# EasyEDA Pro project main_board.eprj

# Schematic Schematic1
Board Name: Board1; Create Date: 2025-07-29; Page Name: P1; Project Name: main_board; Schematic Name: Schematic1; Update Date: 2026-05-09; Company: EasyEDA.com; Page Size: A4; Version: V1.0
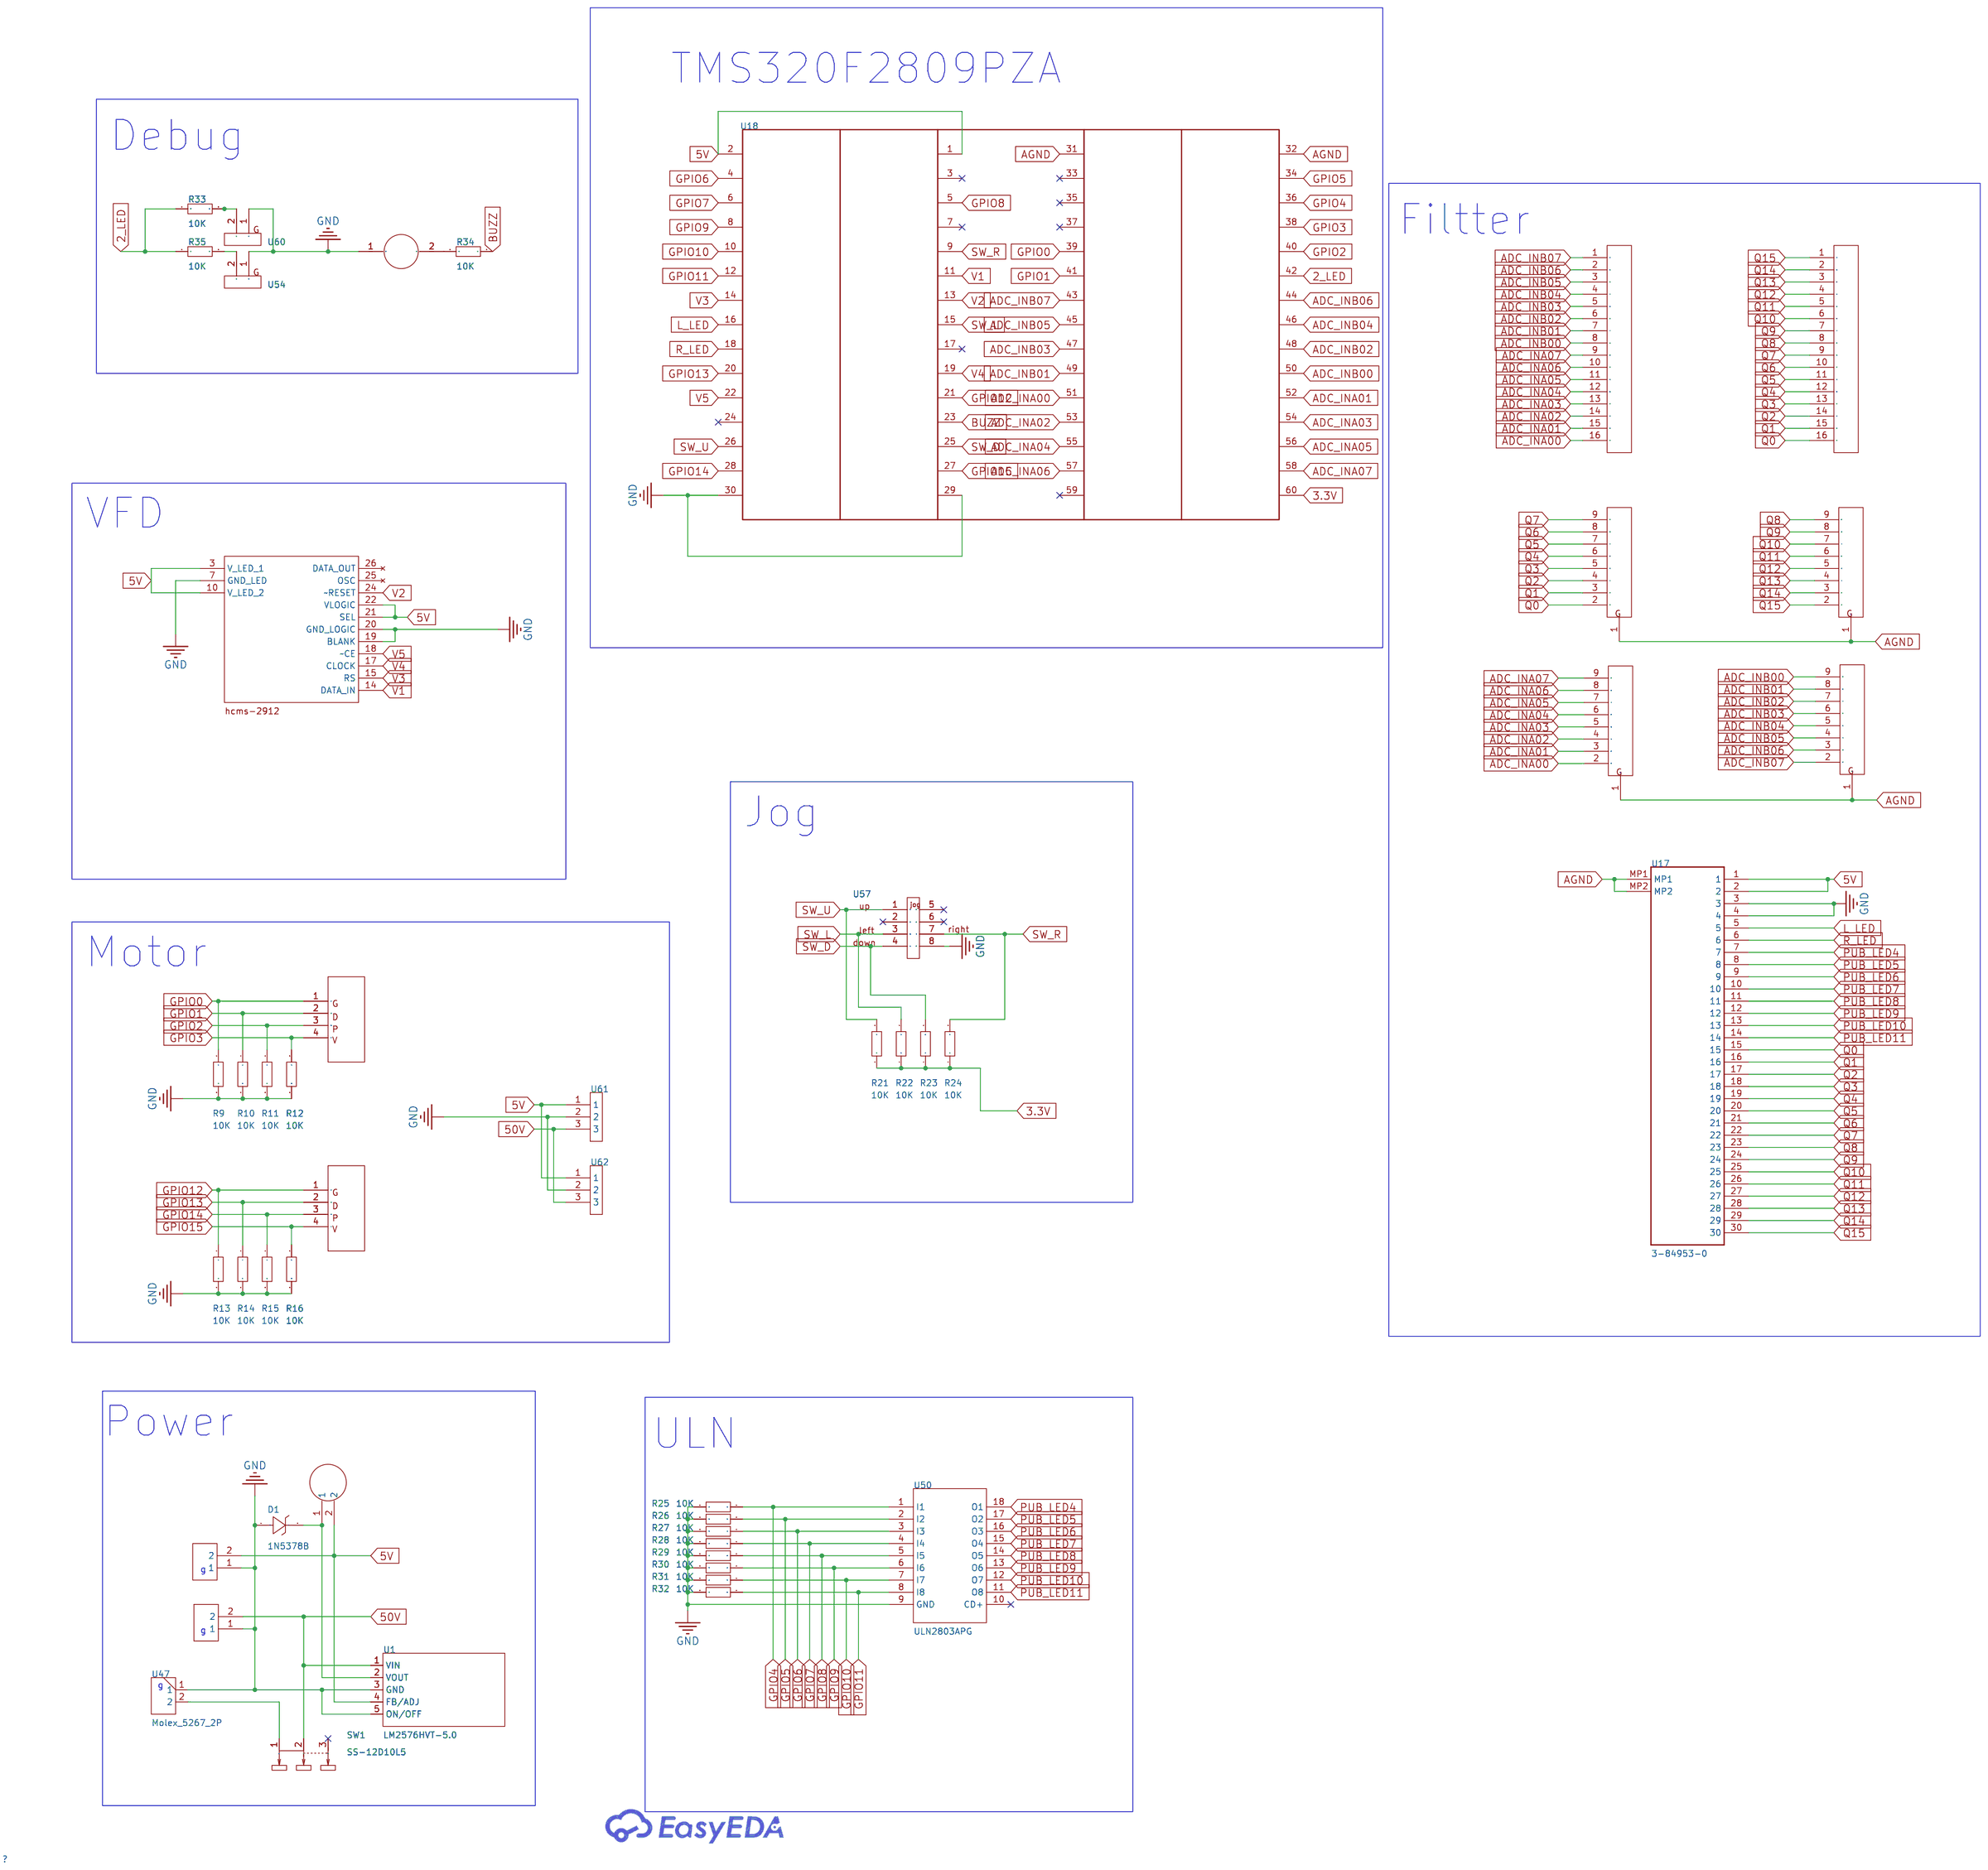
[diagram p0: schematic sheet]

## Parts
C1  -  [100uF Capacitor]
C2  -  [1000uF Capacitor]
D1  1N5378B  [DO-15_BD3.1-L6.7-P10.70-D0.9-FD]
L1  -  [Indoctor]
R9  10K  [R0603]
R10  10K  [R0603]
R11  10K  [R0603]
R12  10K  [R0603]
R13  10K  [R0603]
R14  10K  [R0603]
R15  10K  [R0603]
R16  10K  [R0603]
R21  10K  [R0603]
R22  10K  [R0603]
R23  10K  [R0603]
R24  10K  [R0603]
R25  10K  [R0603]
R26  10K  [R0603]
R27  10K  [R0603]
R28  10K  [R0603]
R29  10K  [R0603]
R30  10K  [R0603]
R31  10K  [R0603]
R32  10K  [R0603]
R33  10K  [R0603]
R34  10K  [R0603]
R35  10K  [R0603]
SW1  SS-12D10L5  [SW-TH_SS-12D10L5]
U1  LM2576HVT-5.0  [TO-220-5L_L10.2-W4.5-P1.71-L]
U4  Driver_R  [DC_Main_to_Motordriver_Connector_L]
U6  -  [BUZZER]
U10  -  [HCMS-2912]
U11  -  [Array]
U12  -  [Array]
U15  -  [C_Array]
U16  -  [C_Array]
U17  3-84953-0  [3849530]
U18  -  [2809PCB]
U47  Molex_5267_2P  [5267_2P]
U48  Driver_L  [DC_Main_to_Motordriver_Connector_L]
U50  ULN2803APG  [DIP-18_L23.0-W6.5-P2.54-LS7.6-BL]
U51  -  [Array]
U52  -  [Array]
U54  -  [pub_pin]
U57  -  [jog]
U60  -  [pub_pin]
U61  -  [pin]
U62  -  [pin]

## Library data of the parts
C1 = 100uF Capacitor
C2 = 1000uF Capacitor
D1 = 1N5378B: Zener Voltage(Nom):100V Reverse Leakage Current (Ir):500nA@76V Pd - Power Dissipation:5W Impedance(Zzt):90Ω; Supplier Part: C2988330; Manufacturer: EIC; Supplier Footprint: DO-15; JLCPCB Part Class: Extended Part; Datasheet: https://atta.szlcsc.com/upload/public/pdf/source/20220402/75CFD8A39FA764DF5610AA6DE4D072CD.pdf; Supplier: LCSC; Zener Voltage(Nom): 100V; Reverse Leakage Current (Ir): 500nA@76V; Pd - Power Dissipation: 5W; Impedance(Zzt): 90Ω
L1 = Indoctor
R9-R16 R21-R35 = Res_0603: Supplier Footprint: 0603
SW1 = SS-12D10L5: LCSC Part Name: 柄长5mm 直插双档 滑动开关; Supplier Part: C319012; Manufacturer: XKB Connectivity(中国星坤); Supplier Footprint: 插件; JLCPCB Part Class: Extended Part; Datasheet: https://atta.szlcsc.com/upload/public/pdf/source/20211009/D6412F37AABE6F9459A6EE7FA4DAEADB.pdf; Supplier: LCSC; Circuit: SPDT; Actuator Style: Rectangular columnar; Pin Style: PCPin; Switch Length: 13mm; Switch Width: 6.8mm; Switch Height: 6.4mm; Mounting Style: Straight; Actuator Color: Black; Current Rating (DC): 3A; Voltage Rating (DC): 125V; Current Rating (AC): 3A; Voltage Rating (AC): 125V; Mechanical Life: 1万次; Operating Temperature: -40℃~+85℃
U1 = LM2576HVT-5.0_C262789: Function:Step-down type Output Type:- Voltage - Supply:- Voltage - Supply:- Output Voltage:- Output Voltage:- Output Current:3A Frequency - Switching:52kHz Frequency - Switching:52kHz Operating Temperature:-40℃~+125℃ Operating Temperature:-40℃~+125℃ Synch; Supplier Part: C262789; Manufacturer: HTC; Supplier Footprint: TO-220-5; JLCPCB Part Class: Extended Part; Datasheet: https://atta.szlcsc.com/upload/public/pdf/source/20191203/C126037_E42ABC3D16C6AA3446C45CA7229A4210.pdf; Supplier: LCSC; Function: Step-down type; Output Current: 3A; Frequency - Switching: 52kHz; Operating Temperature: -40℃~+125℃; Number of Outputs: 1; Topology: Step-down; Switch tube (built-in/external): Built-in
U4 U48 = DC_Main_to_Motordriver_Connector
U6 = BUZZER
U10 = HCMS-2912
U11 U12 U51 U52 = Array
U15 U16 = C_Array
U17 = 3-84953-0
U18 = TMS320F2809PZA_DIP
U47 = Molex_5267_2P
U50 = ULN2803APG: LCSC Part Name: 停产 ULN2803APG; Supplier Part: C5252; Manufacturer: TOSHIBA(东芝); Supplier Footprint: DIP-18; JLCPCB Part Class: Extended Part; Datasheet: https://atta.szlcsc.com/upload/public/pdf/source/20120920/1457706536068.pdf; Supplier: LCSC; number of channels: Eight channels
U54 U60 = pub_pin
U57 = jog
U61 U62 = 3pin

## Nets
3.3V: R21.1 R22.1 R23.1 R24.1 U18.60
5V: C2.2 L1.2 U1.4(FB/ADJ) U10.3(V_LED_1) U10.10(V_LED_2) U10.21(SEL) U10.22(VLOGIC) U17.1 U17.2 U18.1 U18.2 U61.1 U62.1
50V: C1.2 SW1.2 U1.1(VIN) U61.3 U62.3
AGND: U11.1 U12.1 U17.MP1 U17.MP2 U18.31 U18.32 U51.1 U52.1
GND: C1.1 C2.1 D1.1(+) R9.2 R10.2 R11.2 R12.2 R13.2 R14.2 R15.2 R16.2 R25.2 R26.2 R27.2 R28.2 R29.2 R30.2 R31.2 R32.2 U1.3(GND) U1.5(ON/OFF) U6.1 U10.7(GND_LED) U10.19(BLANK) U10.20(GND_LOGIC) U17.3 U17.4 U18.29 U18.30 U47.1 U50.9(GND) U54.1 U57.8 U60.1 U61.2 U62.2
V1: U10.14(DATA_IN) U18.11
V2: U10.24(~RESET) U18.13
V3: U10.15(RS) U18.14
V4: U10.17(CLOCK) U18.19
V5: U10.18(~CE) U18.22
2_LED: R33.1 R35.1 U18.42
ADC_INA00: U15.16 U18.51 U51.2
ADC_INA01: U15.15 U18.52 U51.3
ADC_INA02: U15.14 U18.53 U51.4
ADC_INA03: U15.13 U18.54 U51.5
ADC_INA04: U15.12 U18.55 U51.6
ADC_INA05: U15.11 U18.56 U51.7
ADC_INA06: U15.10 U18.57 U51.8
ADC_INA07: U15.9 U18.58 U51.9
ADC_INB00: U15.8 U18.50 U52.9
ADC_INB01: U15.7 U18.49 U52.8
ADC_INB02: U15.6 U18.48 U52.7
ADC_INB03: U15.5 U18.47 U52.6
ADC_INB04: U15.4 U18.46 U52.5
ADC_INB05: U15.3 U18.45 U52.4
ADC_INB06: U15.2 U18.44 U52.3
ADC_INB07: U15.1 U18.43 U52.2
BUZZ: R34.2 U18.23
GPIO0: R9.1 U4.1 U18.39
GPIO1: R10.1 U4.2 U18.41
GPIO2: R11.1 U4.3 U18.40
GPIO3: R12.1 U4.4 U18.38
GPIO4: R25.1 U18.36 U50.1(I1)
GPIO5: R26.1 U18.34 U50.2(I2)
GPIO6: R27.1 U18.4 U50.3(I3)
GPIO7: R28.1 U18.6 U50.4(I4)
GPIO8: R29.1 U18.5 U50.5(I5)
GPIO9: R30.1 U18.8 U50.6(I6)
GPIO10: R31.1 U18.10 U50.7(I7)
GPIO11: R32.1 U18.12 U50.8(I8)
GPIO12: R13.1 U18.21 U48.1
GPIO13: R14.1 U18.20 U48.2
GPIO14: R15.1 U18.28 U48.3
GPIO15: R16.1 U18.27 U48.4
L_LED: U17.5 U18.16
PUB_LED4: U17.7 U50.18(O1)
PUB_LED5: U17.8 U50.17(O2)
PUB_LED6: U17.9 U50.16(O3)
PUB_LED7: U17.10 U50.15(O4)
PUB_LED8: U17.11 U50.14(O5)
PUB_LED9: U17.12 U50.13(O6)
PUB_LED10: U17.13 U50.12(O7)
PUB_LED11: U17.14 U50.11(O8)
Q0: U11.2 U16.16 U17.15
Q1: U11.3 U16.15 U17.16
Q2: U11.4 U16.14 U17.17
Q3: U11.5 U16.13 U17.18
Q4: U11.6 U16.12 U17.19
Q5: U11.7 U16.11 U17.20
Q6: U11.8 U16.10 U17.21
Q7: U11.9 U16.9 U17.22
Q8: U12.9 U16.8 U17.23
Q9: U12.8 U16.7 U17.24
Q10: U12.7 U16.6 U17.25
Q11: U12.6 U16.5 U17.26
Q12: U12.5 U16.4 U17.27
Q13: U12.4 U16.3 U17.28
Q14: U12.3 U16.2 U17.29
Q15: U12.2 U16.1 U17.30
R_LED: U17.6 U18.18
SW_D: R23.2 U18.25 U57.4
SW_L: R22.2 U18.15 U57.3
SW_R: R24.2 U18.9 U57.7
SW_U: R21.2 U18.26 U57.1
$1N2932: SW1.1 U47.2
$1N3052: D1.2(-) L1.1 U1.2(VOUT)
$1N13779: R34.1 U6.2
$1N16910: R33.2 U60.2
$1N16913: R35.2 U54.2

Not connected (* = marked no-connect by the designer): SW1 3*; U10 25(OSC) 26(DATA_OUT); U18 3* 7* 17* 24* 33* 35* 37* 59*; U50 10(CD+)*; U57 2* 5* 6*

## Notes on the sheet
- TMS320F2809PZA
- Debug
- Filtter
- VFD
- Jog
- Motor
- Power
- ULN
- g
- g
- g

# Board PCB1
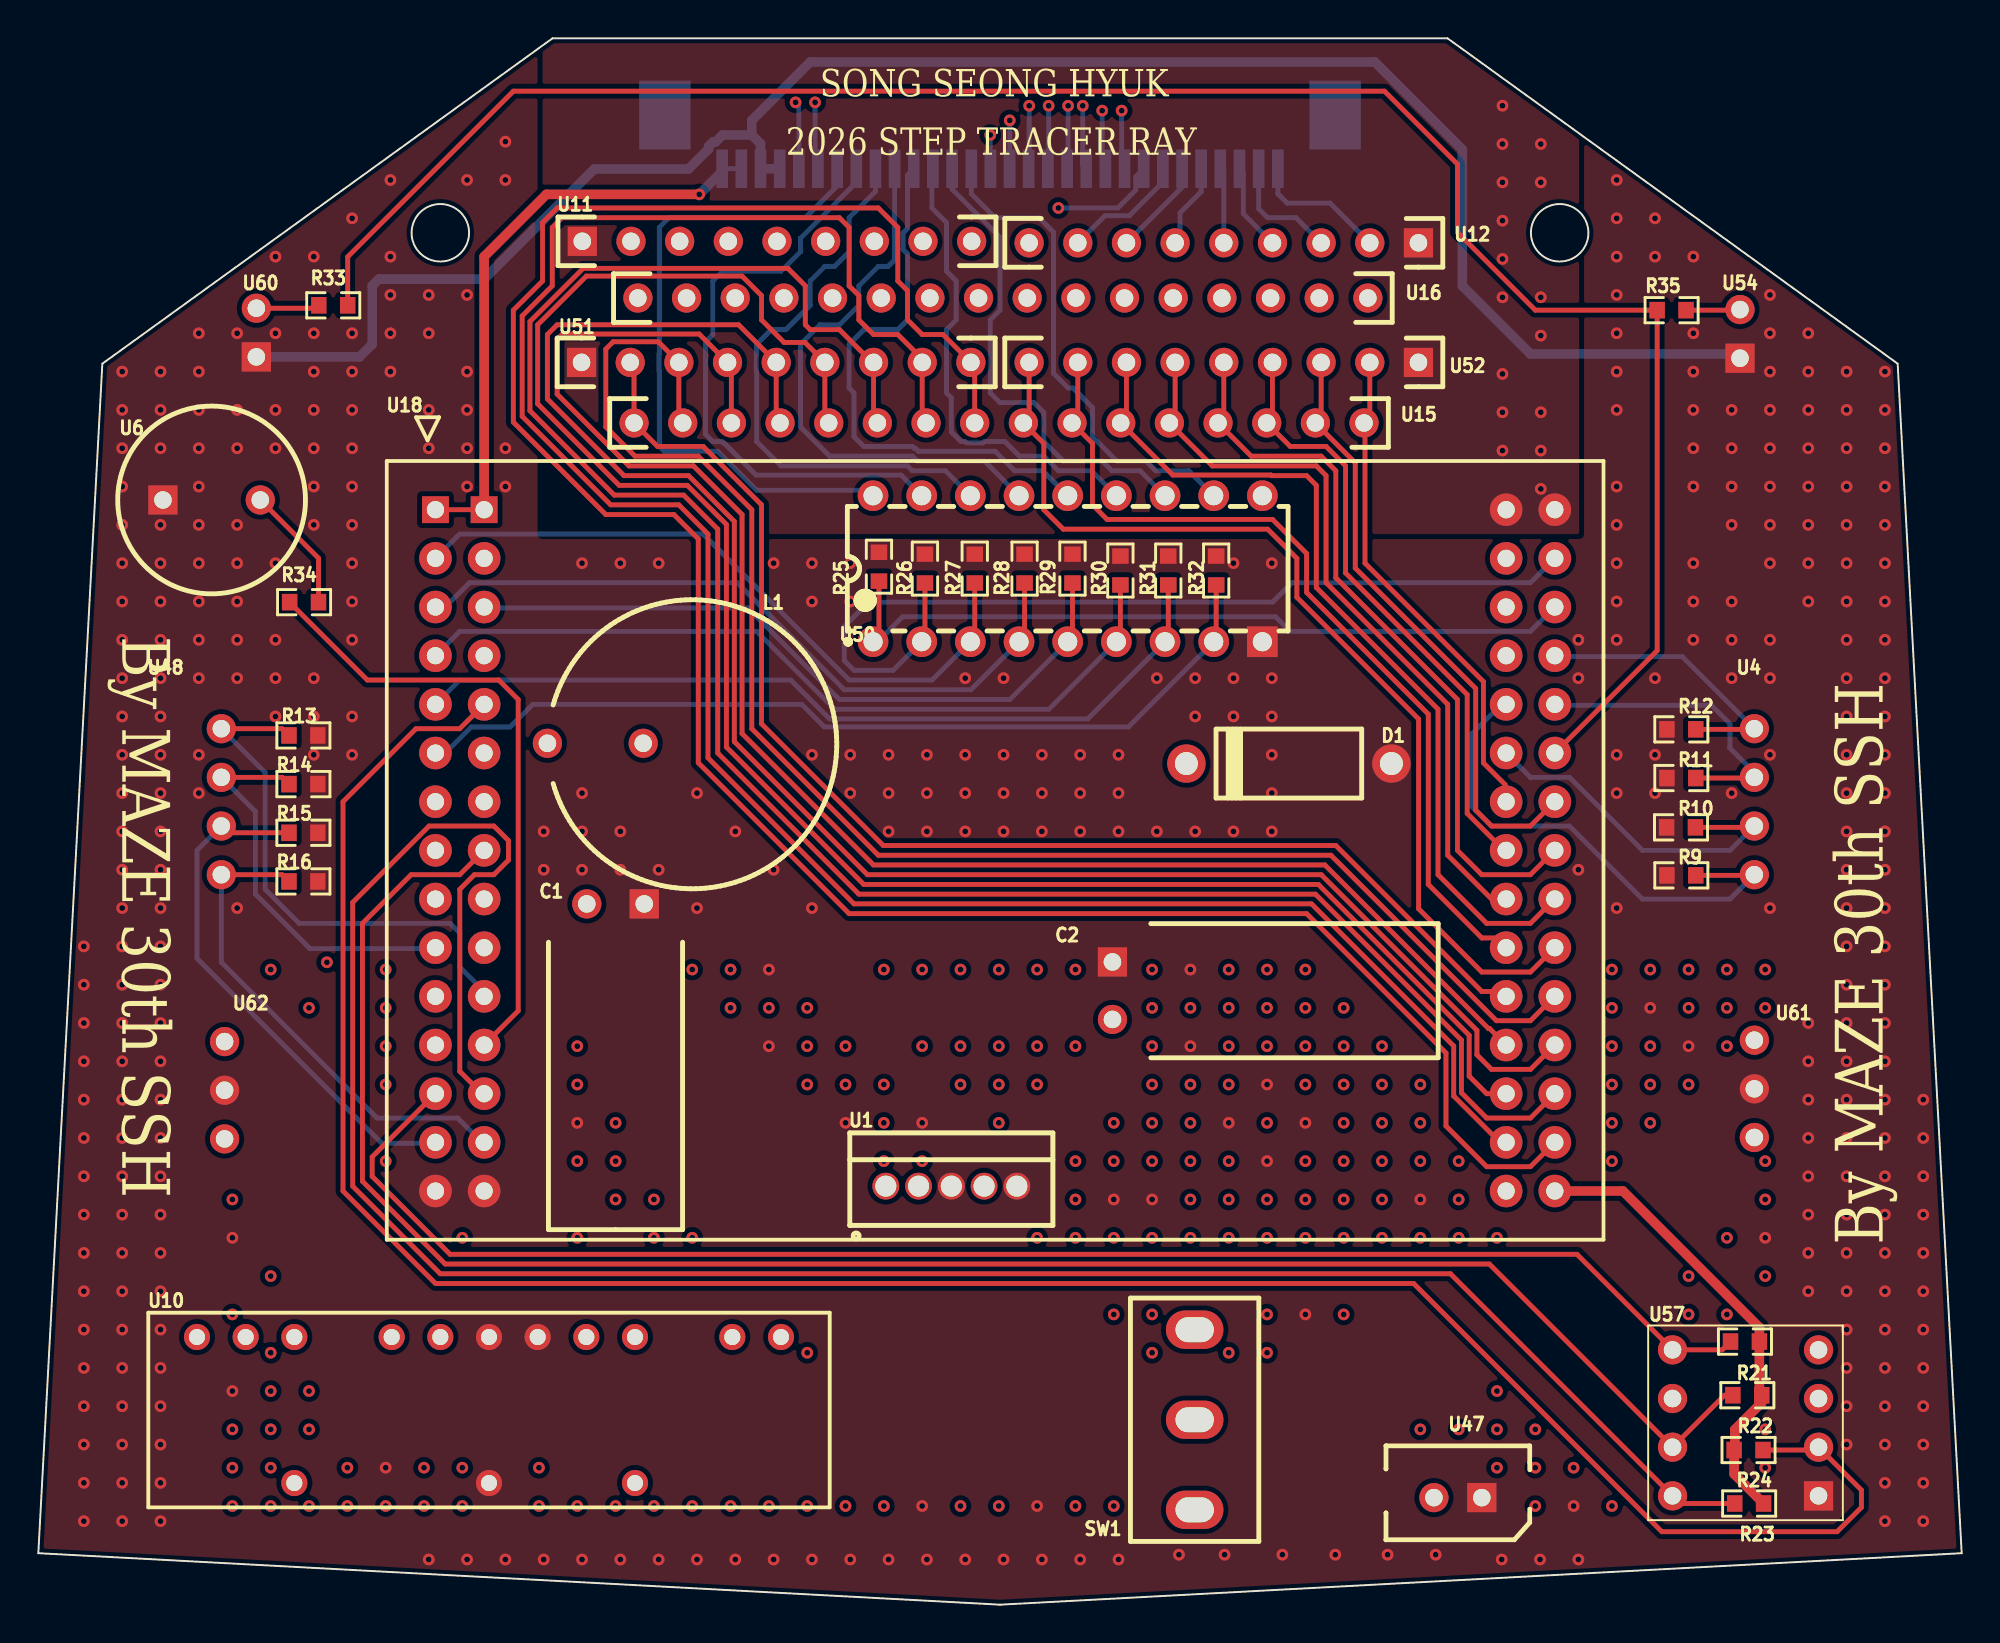
[diagram p1: board, top side]
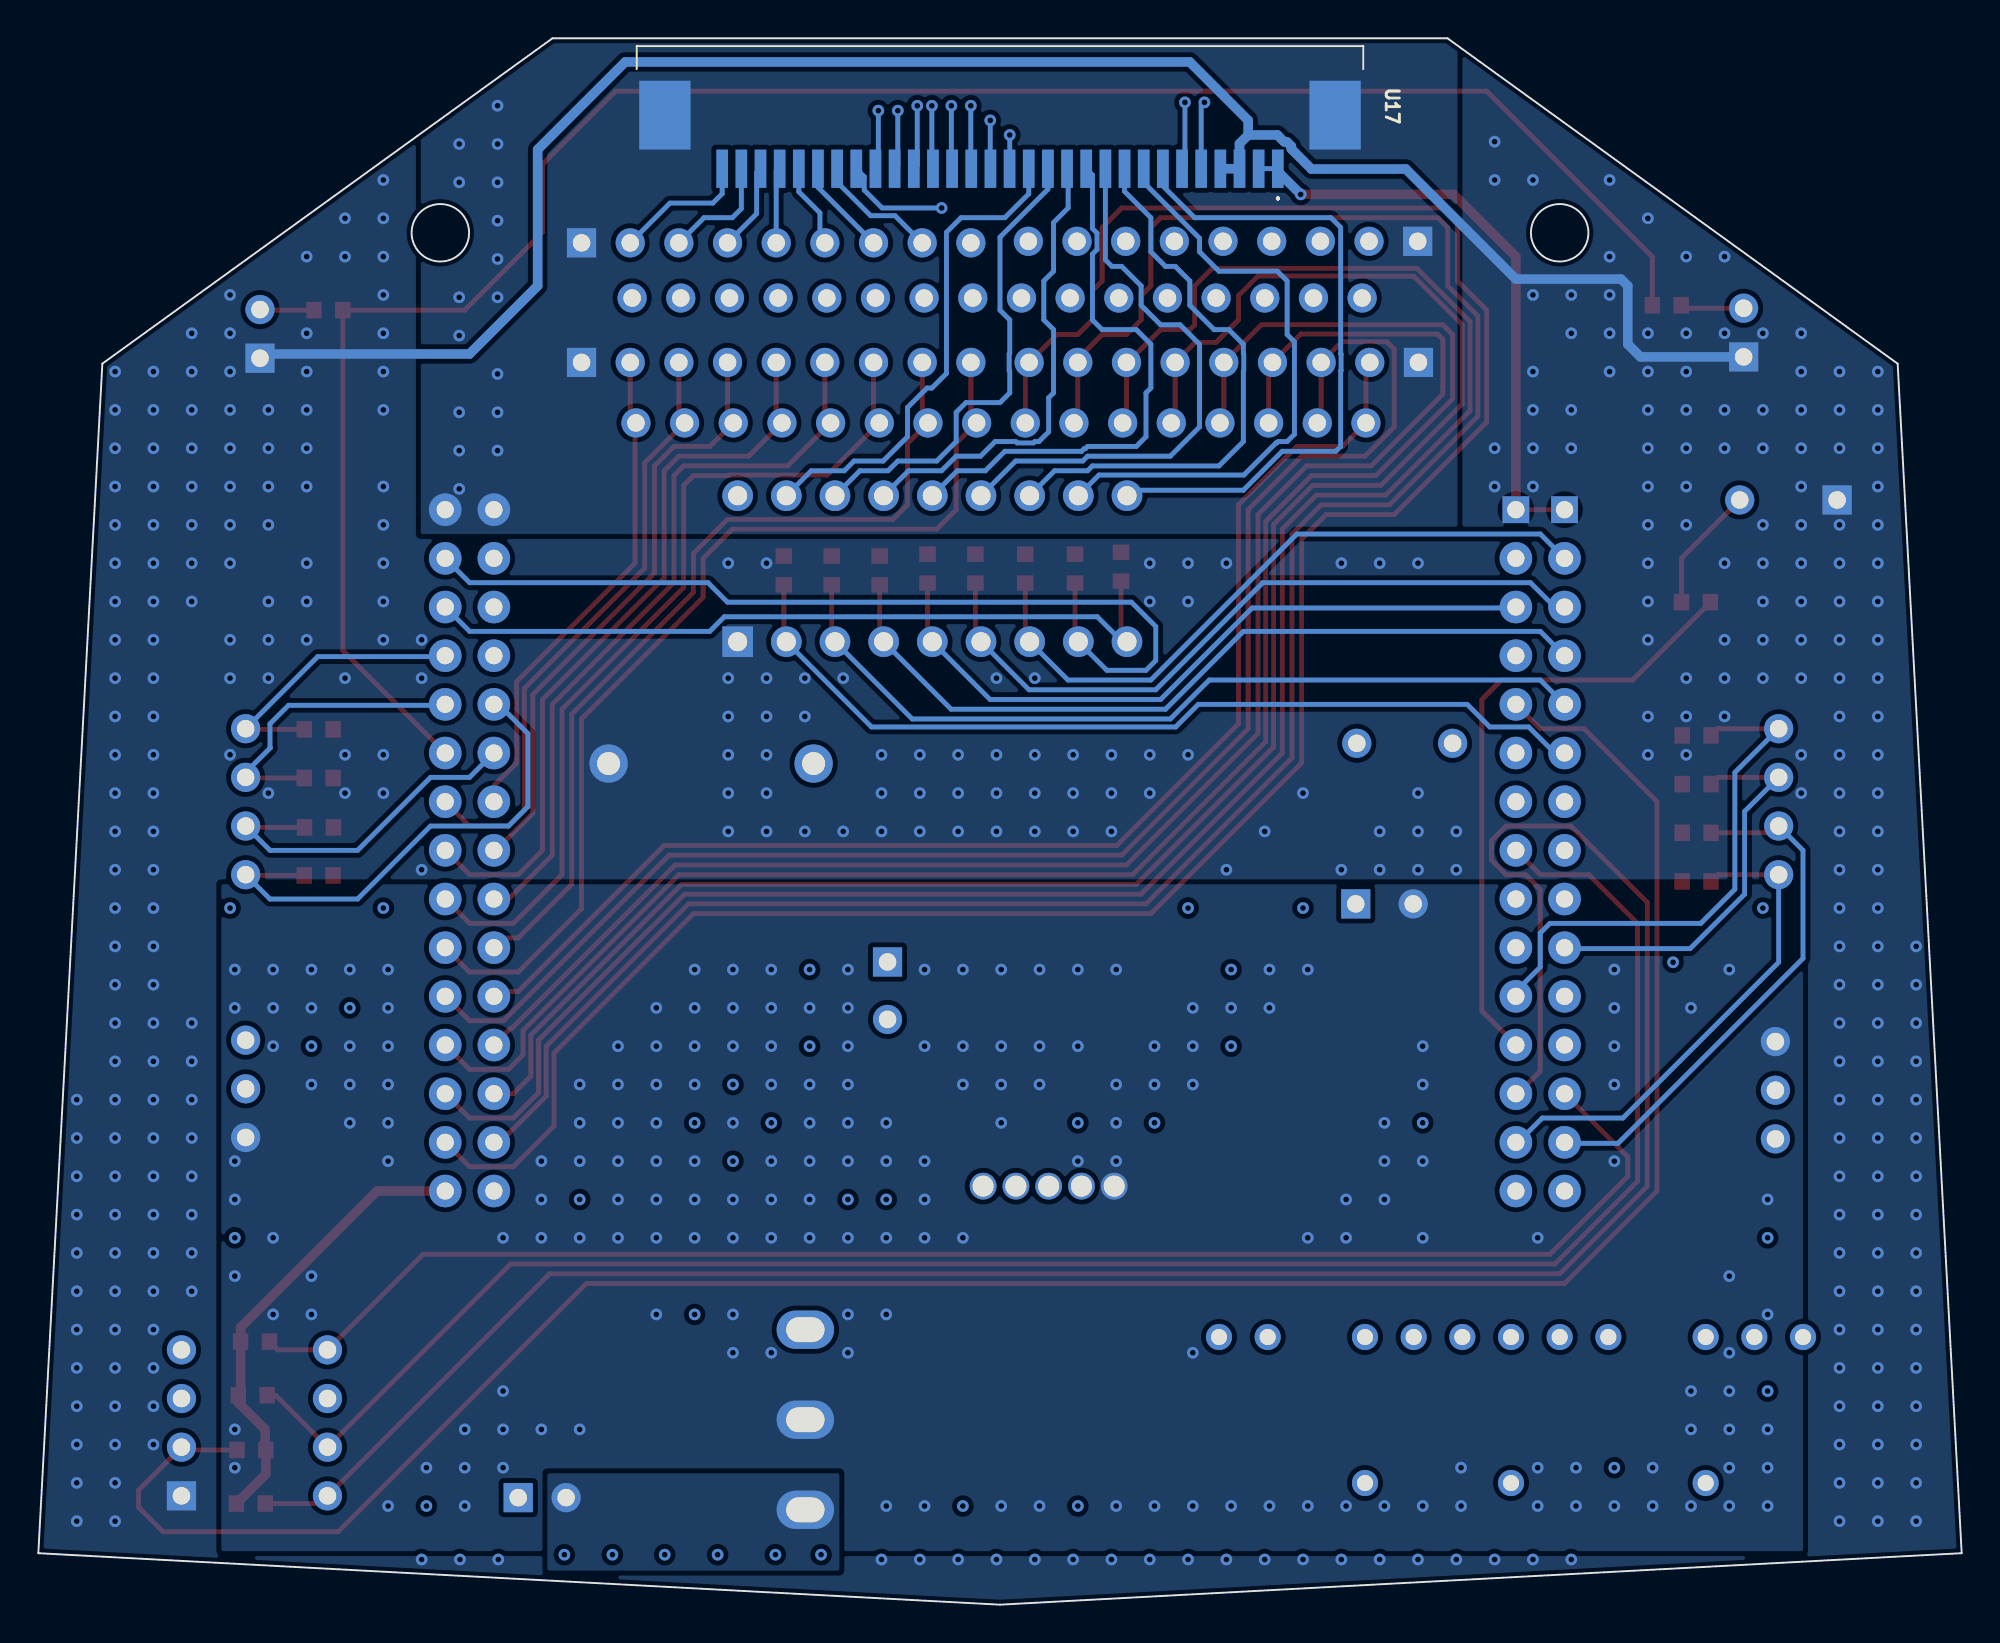
[diagram p2: board, bottom side, seen from below]

Outline 100.38 x 81.75 mm; copper layers: Top Layer, Inner1, Inner2, Bottom Layer. Coordinates in mm from the lower left corner of the outline.
Outline path: circle c20.98,71.6 r1.5 ; circle c79.4,71.6 r1.5 ; 0,2.69 3.34,64.77 26.83,81.75 73.55,81.75 97.04,64.77 100.38,2.69 50.19,0 0,2.69
Stack: Top Layer 0.035mm Outer layer thickness 1oz / Dielectric1 0.2104mm 7628 RC49% 8.6mil / Inner1 0.0152mm Inner layer thickness / Dielectric2 1.065mm 1.1mm H/HOZ Copper / Inner2 0.0152mm Inner layer thickness / Dielectric3 0.2104mm 7628 RC49% 8.6mil / Bottom Layer 0.035mm Outer layer thickness 1oz

## Design rules (mm)
template: Custom Config
spacing copperThickness1oz (default): track to track 0.15, other pairs 0.152 to 0.3
spacing copperThickness2oz: track to track 0.203, other pairs 0.152 to 0.3
track width copperThickness1oz (default): min 0.127, default 0.254, max 2.54
track width copperThickness2oz: min 0.203, default 0.254, max 2.54
differential pair differentialPair (default): width min 0.127, default 0.254, max 2.54; gap min 0.152, default 0.152
via viaSize (default): diameter min 0.5, default 0.61, max 10; hole min 0.3, default 0.305, max 6.3

## Placement (name value [footprint] x y rotation side)
C1  -  [100uF Capacitor]  30.13 36.58 180 top
C2  -  [1000uF Capacitor]  56.06 32.05 270 top
D1  1N5378B  [DO-15_BD3.1-L6.7-P10.70-D0.9-FD]  65.27 43.9 180 top
L1  -  [Indoctor]  26.57 44.96 270 top
R9  10K  [R0603]  85.75 38.07 180 top
R10  10K  [R0603]  85.73 40.57 180 top
R11  10K  [R0603]  85.75 43.15 180 top
R12  10K  [R0603]  85.75 45.69 180 top
R13  10K  [R0603]  13.84 45.37 0 top
R14  10K  [R0603]  13.84 42.83 0 top
R15  10K  [R0603]  13.84 40.29 0 top
R16  10K  [R0603]  13.84 37.75 0 top
R21  10K  [R0603]  89.07 13.73 180 top
R22  10K  [R0603]  89.19 10.93 180 top
R23  10K  [R0603]  89.29 5.28 180 top
R24  10K  [R0603]  89.26 8.07 0 top
R25  10K  [R0603]  43.87 54.18 90 top
R26  10K  [R0603]  46.27 54.08 90 top
R27  10K  [R0603]  48.87 54.08 90 top
R28  10K  [R0603]  51.47 54.08 90 top
R29  10K  [R0603]  53.97 54.08 90 top
R30  10K  [R0603]  56.47 53.98 90 top
R31  10K  [R0603]  58.97 53.98 90 top
R32  10K  [R0603]  61.47 53.98 90 top
R33  10K  [R0603]  15.39 67.82 180 top
R34  10K  [R0603]  13.87 52.32 180 top
R35  10K  [R0603]  85.24 67.56 0 top
SW1  SS-12D10L5  [SW-TH_SS-12D10L5]  60.35 9.65 90 top
U1  LM2576HVT-5.0  [TO-220-5L_L10.2-W4.5-P1.71-L]  47.65 21.84 0 top
U4  Driver_R  [DC_Main_to_Motordriver_Connector_L]  89.56 41.91 180 top
U6  -  [BUZZER]  9.04 57.66 0 top
U10  -  [HCMS-2912]  13.36 6.35 0 top
U11  -  [Array]  28.39 71.16 0 top
U12  -  [Array]  72.03 71.08 180 top
U15  -  [C_Array]  69.19 61.68 180 top
U16  -  [C_Array]  69.39 68.2 180 top
U17  3-84953-0  [3849530]  50.19 75.95 0 bottom
U18  TMS320F2809PZA_DIP  [2809PCB]  20.73 57.15 0 top
U47  Molex_5267_2P  [5267_2P]  75.34 5.59 180 top
U48  Driver_L  [DC_Main_to_Motordriver_Connector_L]  9.55 41.91 0 top
U50  ULN2803APG  [DIP-18_L23.0-W6.5-P2.54-LS7.6-BL]  53.72 54.07 0 top
U51  -  [Array]  28.35 64.84 0 top
U52  -  [Array]  72.03 64.84 180 top
U54  -  [pub_pin]  88.81 66.71 180 top
U57  -  [jog]  89.1 9.49 0 top
U60  -  [pub_pin]  11.38 66.78 180 top
U61  -  [pin]  89.56 26.92 270 top
U62  -  [pin]  9.72 26.85 90 top

## Footprints (pads in the part's own frame, mm; a bottom-side part is the same pattern mirrored in y, then rotated)
100uF Capacitor
  rect 1.524x1.524 hole 0.914: 1(-1.5,0)
  round 1.524 hole 0.914: 2(1.5,0)
1000uF Capacitor
  rect 1.524x1.524 hole 0.914: 1(-1.5,0)
  round 1.524 hole 0.914: 2(1.5,0)
2809PCB
  rect 1.4x1.4 hole 0.9: 1(2.54,0) 2(0,0)
  round 1.7 hole 0.9: 3(2.54,-2.54) 4(0,-2.54) 5(2.54,-5.08) 6(0,-5.08) 7(2.54,-7.62) 8(0,-7.62) 9(2.54,-10.16) 10(0,-10.16) 11(2.54,-12.7) 12(0,-12.7) 13(2.54,-15.24) 14(0,-15.24) 15(2.54,-17.78) 16(0,-17.78) 17(2.54,-20.32) 18(0,-20.32) 19(2.54,-22.86) 20(0,-22.86) 21(2.54,-25.4) 22(0,-25.4) 23(2.54,-27.94) 24(0,-27.94) 25(2.54,-30.48) 26(0,-30.48) 27(2.54,-33.02) 28(0,-33.02) 29(2.54,-35.56) 30(0,-35.56) 31(55.88,0) 32(58.42,0) 33(55.88,-2.54) 34(58.42,-2.54) 35(55.88,-5.08) 36(58.42,-5.08) 37(55.88,-7.62) 38(58.42,-7.62) 39(55.88,-10.16) 40(58.42,-10.16) 41(55.88,-12.7) 42(58.42,-12.7) 43(55.88,-15.24) 44(58.42,-15.24) 45(55.88,-17.78) 46(58.42,-17.78) 47(55.88,-20.32) 48(58.42,-20.32) 49(55.88,-22.86) 50(58.42,-22.86) 51(55.88,-25.4) 52(58.42,-25.4) 53(55.88,-27.94) 54(58.42,-27.94) 55(55.88,-30.48) 56(58.42,-30.48) 57(55.88,-33.02) 58(58.42,-33.02) 59(55.88,-35.56) 60(58.42,-35.56)
5267_2P
  rect 1.524x1.524 hole 0.914: 1(0,0)
  round 1.524 hole 0.914: 2(2.5,0)
3849530
  rect 0.61x2 smd: 1(-14.5,1) 2(-13.5,1) 3(-12.5,1) 4(-11.5,1) 5(-10.5,1) 6(-9.5,1) 7(-8.5,1) 8(-7.5,1) 9(-6.5,1) 10(-5.5,1) 11(-4.5,1) 12(-3.5,1) 13(-2.5,1) 14(-1.5,1) 15(-0.5,1) 16(0.5,1) 17(1.5,1) 18(2.5,1) 19(3.5,1) 20(4.5,1) 21(5.5,1) 22(6.5,1) 23(7.5,1) 24(8.5,1) 25(9.5,1) 26(10.5,1) 27(11.5,1) 28(12.5,1) 29(13.5,1) 30(14.5,1)
  rect 2.68x3.6 smd: MP1(-17.49,-1.8) MP2(17.49,-1.8)
Array
  rect 1.524x1.524 hole 0.914: 1(0,0)
  round 1.524 hole 0.914: 2(2.54,0) 3(5.08,0) 4(7.62,0) 5(10.16,0) 6(12.7,0) 7(15.24,0) 8(17.78,0) 9(20.32,0)
BUZZER
  rect 1.524x1.524 hole 0.914: 1(-2.54,0)
  round 1.524 hole 0.914: 2(2.54,0)
C_Array
  round 1.524 hole 0.914: 1(0,0) 2(2.54,0) 3(5.08,0) 4(7.62,0) 5(10.16,0) 6(12.7,0) 7(15.24,0) 8(17.78,0) 9(20.32,0) 10(22.86,0) 11(25.4,0) 12(27.94,0) 13(30.48,0) 14(33.02,0) 15(35.56,0) 16(38.1,0)
DC_Main_to_Motordriver_Connector_L
  round 1.524 hole 0.914: 0(0,3.81) 1(0,1.27) 2(0,-1.27) 3(0,-3.81)
DIP-18_L23.0-W6.5-P2.54-LS7.6-BL
  round 1.6 hole 1: 1(-10.16,-3.81) 2(-7.62,-3.81) 3(-5.08,-3.81) 4(-2.54,-3.81) 5(0,-3.81) 6(2.54,-3.81) 7(5.08,-3.81) 8(7.62,-3.81) 10(10.16,3.81) 11(7.62,3.81) 12(5.08,3.81) 13(2.54,3.81) 14(0,3.81) 15(-2.54,3.81) 16(-5.08,3.81) 17(-7.62,3.81) 18(-10.16,3.81)
  rect 1.6x1.6 hole 1: 9(10.16,-3.81)
DO-15_BD3.1-L6.7-P10.70-D0.9-FD
  round 2 hole 1.2: 1(-5.35,0) 2(5.35,0)
HCMS-2912
  round 1.365 hole 0.84: 3(0,0) 7(10.16,0) 10(17.78,0) 14(25.4,7.62) 15(22.86,7.62) 17(17.78,7.62) 18(15.24,7.62) 19(12.7,7.62) 20(10.16,7.62) 21(7.62,7.62) 22(5.08,7.62) 24(0,7.62) 25(-2.54,7.62) 26(-5.08,7.62)
Indoctor
  round 1.524 hole 0.914: 1(0,0) 2(0,5)
jog
  round 1.524 hole 0.914: 2(-3.81,1.27) 5(3.81,3.81) 6(3.81,1.27) D(-3.81,-3.81) L(-3.81,-1.27) R(3.81,-1.27) U(-3.81,3.81)
  rect 1.524x1.524 hole 0.914: 8(3.81,-3.81)
pin
  round 1.524 hole 0.914: 1(-2.54,0) 2(0,0) 3(2.54,0)
pub_pin
  rect 1.524x1.524 hole 0.914: 1(0,1.651)
  round 1.524 hole 0.914: 2(0,-0.889)
R0603
  rect 0.806x0.864 smd: 1(-0.753,0) 2(0.753,0)
SW-TH_SS-12D10L5
  oval 2x3 hole 1.3x2: 1(-4.7,0) 2(0,0) 3(4.7,0)
TO-220-5L_L10.2-W4.5-P1.71-L
  round 1.4 hole 1.1: 1(-3.42,0) 2(-1.71,0) 3(0,0) 4(1.71,0) 5(3.42,0)

## Nets
As in the schematic, except:
GPIO0: R9.1 U4.0 U18.39
GPIO1: R10.1 U4.1 U18.41
GPIO2: R11.1 U4.2 U18.40
GPIO3: R12.1 U4.3 U18.38
GPIO12: R13.1 U18.21 U48.0
GPIO13: R14.1 U18.20 U48.1
GPIO14: R15.1 U18.28 U48.2
GPIO15: R16.1 U18.27 U48.3
SW_D: R23.2 U18.25 U57.D
SW_L: R22.2 U18.15 U57.L
SW_R: R24.2 U18.9 U57.R
SW_U: R21.2 U18.26 U57.U

Pads without a net: SW1 3; U10 25 26; U18 3 7 17 24 33 35 37 59; U50 10; U57 2 5 6

## Via types
v1: diameter 0.61, hole 0.305, Top Layer to Bottom Layer, 620 vias

## Routing (per net, layer and track width the routed paths; a pad name or vN(x,y) marks a point on that pad's centre or on a via; arc(x,y) is an arc through that point)
3.3V: length 23.8
  Top Layer w0.5: 79.4,21.59 82.7,21.59 89.83,14.47 R21.1 89.83,11.05 R22.1 89.95,10.55 88.55,9.14 88.55,8.11 R24.1 88.51,6.82 R23.1
5V: length 201.4
  Top Layer w0.254: U18.2 U18.1
  Top Layer w0.5: v1(34.5,73.61) 26.52,73.61 23.27,70.36 23.27,57.4
  Inner1 w0.5: U61.1 77.12,17.02 52.66,17.02 49.36,20.32 ; 23.21,57.1 31.57,48.74 L1.2 31.57,43.43 44.46,30.55 C2.2 56.06,28.48 49.42,21.84 U1.4 49.36,20.32 ; U10.3 18.44,11.43 U10.22 ; U10.22 9.72,22.69 U62.1 ; U10.22 U10.21 28.6,6.35 U10.10 35.39,6.35 49.36,20.32
  Bottom Layer w0.254: U17.2 U17.1 ; C2.2 56.06,30.8
  Bottom Layer w0.5: v1(34.5,73.61) 35.69,74.8 U17.1
50V:
  vias: v1(10.13,21.15) v1(10.13,15.15) v1(10.13,9.15) v1(10.13,7.15) v1(10.13,5.15) v1(12.13,33.15) v1(12.13,17.15) v1(12.13,13.15) v1(12.13,11.15) v1(12.13,9.15) v1(12.13,7.15) v1(12.13,5.15) v1(14.13,31.15) v1(14.13,11.15) v1(14.13,9.15) v1(14.13,5.15) v1(16.13,7.15) v1(16.13,5.15) v1(18.13,33.15) v1(18.13,31.15) v1(18.13,29.15) v1(18.13,27.15) v1(18.13,23.15) v1(18.13,5.15) v1(20.13,7.15) v1(20.13,5.15) v1(22.13,19.15) v1(22.13,7.15) v1(22.13,5.15) v1(26.13,7.15) v1(26.13,5.15) v1(28.13,29.15) v1(28.13,27.15) v1(28.13,23.15) v1(28.13,19.15) v1(28.13,5.15) v1(30.13,25.15) v1(30.13,23.15) v1(30.13,21.15) v1(30.13,5.15) v1(32.13,21.15) v1(32.13,19.15) v1(32.13,5.15) v1(34.13,33.15) v1(34.13,19.15) v1(34.13,5.15) v1(36.13,33.15) v1(36.13,31.15) v1(36.13,5.15) v1(38.13,31.15) v1(38.13,5.15) v1(40.13,31.15) v1(40.13,29.15) v1(40.13,27.15) v1(40.13,13.15) v1(40.13,5.15) v1(42.13,29.15) v1(42.13,27.15) v1(42.13,5.15) v1(44.13,33.15) v1(44.13,27.15) v1(44.13,25.15) v1(44.13,23.15) v1(44.13,5.15) v1(46.13,33.15) v1(46.13,29.15) v1(46.13,23.15) v1(48.13,33.15) v1(48.13,29.15) v1(48.13,27.15) v1(48.13,5.15) v1(50.13,33.15) v1(50.13,29.15) v1(50.13,27.15) v1(50.13,25.15) v1(50.13,5.15) v1(52.13,33.15) v1(52.13,29.15) v1(52.13,27.15) v1(52.13,19.15) v1(54.13,33.15) v1(54.13,29.15) v1(54.13,23.15) v1(54.13,21.15) v1(54.13,19.15) v1(54.13,5.15) v1(56.13,25.15) v1(56.13,23.15) v1(56.13,19.15) v1(56.13,15.15) v1(56.13,5.15) v1(58.13,33.15) v1(58.13,31.15) v1(58.13,29.15) v1(58.13,27.15) v1(58.13,25.15) v1(58.13,23.15) v1(58.13,19.15) v1(58.13,15.15) v1(58.13,13.15) v1(60.13,31.15) v1(60.13,27.15) v1(60.13,25.15) v1(60.13,23.15) v1(60.13,21.15) v1(60.13,19.15) v1(62.13,33.15) v1(62.13,31.15) v1(62.13,29.15) v1(62.13,27.15) v1(62.13,23.15) v1(62.13,21.15) v1(62.13,19.15) v1(62.13,13.15) v1(64.13,33.15) v1(64.13,31.15) v1(64.13,29.15) v1(64.13,25.15) v1(64.13,21.15) v1(64.13,19.15) v1(64.13,15.15) v1(64.13,13.15) v1(66.13,33.15) v1(66.13,31.15) v1(66.13,29.15) v1(66.13,27.15) v1(66.13,23.15) v1(66.13,21.15) v1(66.13,19.15) v1(68.13,31.15) v1(68.13,29.15) v1(68.13,27.15) v1(68.13,25.15) v1(68.13,23.15) v1(68.13,21.15) v1(68.13,19.15) v1(68.13,15.15) v1(70.13,29.15) v1(70.13,27.15) v1(70.13,25.15) v1(70.13,23.15) v1(70.13,21.15) v1(70.13,19.15) v1(72.13,27.15) v1(72.13,25.15) v1(72.13,23.15) v1(72.13,19.15) v1(72.13,9.15) v1(74.13,23.15) v1(74.13,21.15) v1(74.13,19.15) v1(74.13,9.15) v1(76.13,19.15) v1(76.13,11.15) v1(76.13,9.15) v1(76.13,7.15) v1(78.13,9.15) v1(78.13,7.15) v1(78.13,5.15) v1(80.13,7.15) v1(82.13,33.15) v1(82.13,31.15) v1(82.13,29.15) v1(82.13,27.15) v1(82.13,25.15) v1(82.13,23.15) v1(82.13,5.15) v1(84.13,33.15) v1(84.13,29.15) v1(84.13,27.15) v1(84.13,25.15) v1(86.13,33.15) v1(86.13,31.15) v1(86.13,27.15) v1(86.13,17.15) v1(86.13,15.15) v1(88.13,33.15) v1(88.13,31.15) v1(88.13,29.15) v1(88.13,19.15) v1(88.13,15.15) v1(90.13,33.15) v1(90.13,31.15) v1(90.13,23.15) v1(90.13,21.15) v1(90.13,17.15) v1(90.13,9.15) v1(90.13,7.15)
AGND:
  vias: v1(76.42,78.24) v1(76.42,76.24) v1(76.42,74.24) v1(76.42,72.24) v1(76.42,70.24) v1(76.42,68.24) v1(76.42,64.24) v1(76.42,62.24) v1(76.42,60.24) v1(78.42,76.24) v1(78.42,74.24) v1(78.42,68.24) v1(78.42,66.24) v1(78.42,62.24) v1(78.42,60.24) v1(78.42,58.24)
GND: length 99.6
  Bottom Layer w0.5: 37.24,76.71 37.24,77.47 40.29,80.52 69.75,80.52 74.32,75.95 74.32,68.83 77.88,65.28 88.59,65.28 U54.1 ; 37.24,76.71 37.69,76.25 U17.3 U17.4 ; 37.24,76.71 35.71,76.71 35.35,76.35 35.22,76.35 34.98,76.11 34.98,75.98 33.94,74.93 29.01,74.93 23.27,69.19 17.78,69.19 17.43,68.83 17.43,65.79 16.77,65.13 U60.1
  vias: v1(2.38,34.36) v1(2.38,32.36) v1(2.38,30.36) v1(2.38,28.36) v1(2.38,26.36) v1(2.38,24.36) v1(2.38,22.36) v1(2.38,20.36) v1(2.38,18.36) v1(2.38,16.36) v1(2.38,14.36) v1(2.38,12.36) v1(2.38,10.36) v1(2.38,8.36) v1(2.38,6.36) v1(2.38,4.36) v1(4.38,64.36) v1(4.38,62.36) v1(4.38,60.36) v1(4.38,58.36) v1(4.38,56.36) v1(4.38,54.36) v1(4.38,52.36) v1(4.38,50.36) v1(4.38,48.36) v1(4.38,46.36) v1(4.38,44.36) v1(4.38,42.36) v1(4.38,40.36) v1(4.38,38.36) v1(4.38,36.36) v1(4.38,34.36) v1(4.38,32.36) v1(4.38,30.36) v1(4.38,28.36) v1(4.38,26.36) v1(4.38,24.36) v1(4.38,22.36) v1(4.38,20.36) v1(4.38,18.36) v1(4.38,16.36) v1(4.38,14.36) v1(4.38,12.36) v1(4.38,10.36) v1(4.38,8.36) v1(4.38,6.36) v1(4.38,4.36) v1(6.38,64.36) v1(6.38,62.36) v1(6.38,60.36) v1(6.38,56.36) v1(6.38,54.36) v1(6.38,52.36) v1(6.38,50.36) v1(6.38,48.36) v1(6.38,46.36) v1(6.38,44.36) v1(6.38,42.36) v1(6.38,40.36) v1(6.38,38.36) v1(6.38,36.36) v1(6.38,34.36) v1(6.38,32.36) v1(6.38,30.36) v1(6.38,28.36) v1(6.38,26.36) v1(6.38,24.36) v1(6.38,22.36) v1(6.38,20.36) v1(6.38,18.36) v1(6.38,16.36) v1(6.38,14.36) v1(6.38,12.36) v1(6.38,10.36) v1(6.38,8.36) v1(6.38,6.36) v1(6.38,4.36) v1(8.38,66.36) v1(8.38,64.36) v1(8.38,62.36) v1(8.38,60.36) v1(8.38,58.36) v1(8.38,56.36) v1(8.38,54.36) v1(8.38,52.36) v1(8.38,50.36) v1(8.38,48.36) v1(8.38,44.36) v1(8.38,42.36) v1(10.13,19.15) v1(10.13,11.15) v1(10.38,66.36) v1(10.38,62.36) v1(10.38,60.36) v1(10.38,56.36) v1(10.38,54.36) v1(10.38,52.36) v1(10.38,50.36) v1(10.38,48.36) v1(10.38,36.36) v1(12.38,70.36) v1(12.38,66.36) v1(12.38,62.36) v1(12.38,60.36) v1(12.38,54.36) v1(12.38,50.36) v1(12.38,48.36) v1(12.38,46.36) v1(14.38,70.36) v1(14.38,66.36) v1(14.38,64.36) v1(14.38,62.36) v1(14.38,60.36) v1(14.38,58.36) v1(14.38,56.36) v1(14.38,48.36) v1(14.38,46.36) v1(14.38,44.36) v1(16.38,72.36) v1(16.38,66.36) v1(16.38,64.36) v1(16.38,62.36) v1(16.38,60.36) v1(16.38,58.36) v1(16.38,56.36) v1(16.38,54.36) v1(16.38,52.36) v1(16.38,50.36) v1(16.38,46.36) v1(16.38,44.36) v1(18.13,7.15) v1(18.38,74.36) v1(18.38,70.36) v1(18.38,68.36) v1(18.38,66.36) v1(18.38,64.36) v1(20.38,68.36) v1(20.38,66.36) v1(20.38,62.36) v1(20.38,60.36) v1(20.38,2.36) v1(22.38,74.36) v1(22.38,68.36) v1(22.38,64.36) v1(22.38,62.36) v1(22.38,60.36) v1(22.38,58.36) v1(22.38,2.36) v1(24.38,76.36) v1(24.38,74.36) v1(24.38,60.36) v1(24.38,58.36) v1(24.38,2.36) v1(26.38,40.36) v1(26.38,38.36) v1(26.38,2.36) v1(28.13,25.15) v1(28.38,54.36) v1(28.38,42.36) v1(28.38,40.36) v1(28.38,38.36) v1(28.38,2.36) v1(30.38,54.36) v1(30.38,40.36) v1(30.38,38.36) v1(30.38,2.36) v1(32.38,54.36) v1(32.38,38.36) v1(32.38,2.36) v1(34.38,42.36) v1(34.38,36.36) v1(34.38,2.36) v1(36.38,40.36) v1(36.38,2.36) v1(38.13,33.15) v1(38.13,29.15) v1(38.38,54.36) v1(38.38,38.36) v1(38.38,2.36) v1(40.38,54.36) v1(40.38,52.36) v1(40.38,44.36) v1(40.38,36.36) v1(40.38,2.36) v1(42.13,25.15) v1(42.38,54.36) v1(42.38,52.36) v1(42.38,44.36) v1(42.38,42.36) v1(42.38,2.36) v1(44.38,44.36) v1(44.38,42.36) v1(44.38,40.36) v1(44.38,2.36) v1(46.13,25.15) v1(46.13,5.15) v1(46.38,44.36) v1(46.38,42.36) v1(46.38,40.36) v1(46.38,2.36) v1(48.38,48.36) v1(48.38,44.36) v1(48.38,42.36) v1(48.38,40.36) v1(48.38,2.36) v1(50.38,48.36) v1(50.38,44.36) v1(50.38,42.36) v1(50.38,40.36) v1(50.38,2.36) v1(52.13,5.15) v1(52.38,44.36) v1(52.38,42.36) v1(52.38,40.36) v1(52.38,2.36) v1(54.38,44.36) v1(54.38,42.36) v1(54.38,40.36) v1(54.38,2.36) v1(56.13,21.15) v1(56.38,44.36) v1(56.38,42.36) v1(56.38,40.36) v1(56.38,2.36) v1(58.13,21.15) v1(58.38,48.36) v1(58.38,40.36) v1(59.53,2.61) v1(60.13,33.15) v1(60.13,29.15) v1(60.38,48.36) v1(60.38,46.36) v1(60.38,40.36) v1(61.91,2.61) v1(62.13,25.15) v1(62.38,54.36) v1(62.38,48.36) v1(62.38,46.36) v1(62.38,44.36) v1(62.38,42.36) v1(62.38,40.36) v1(64.13,27.15) v1(64.13,23.15) v1(64.38,54.36) v1(64.38,48.36) v1(64.38,46.36) v1(64.38,44.36) v1(64.38,42.36) v1(64.38,40.36) v1(64.93,2.61) v1(66.13,25.15) v1(66.13,15.15) v1(67.69,2.61) v1(70.42,2.61) v1(72.13,21.15) v1(72.93,2.61) v1(76.38,2.36) v1(78.38,2.36) v1(80.13,5.15) v1(80.38,50.36) v1(80.38,48.36) v1(80.38,38.36) v1(80.38,2.36) v1(82.38,74.36) v1(82.38,72.36) v1(82.38,70.36) v1(82.38,68.36) v1(82.38,66.36) v1(82.38,64.36) v1(82.38,62.36) v1(82.38,58.36) v1(82.38,56.36) v1(82.38,54.36) v1(82.38,52.36) v1(82.38,50.36) v1(82.38,44.36) v1(82.38,42.36) v1(82.38,36.36) v1(84.13,31.15) v1(84.38,72.36) v1(84.38,70.36) v1(84.38,48.36) v1(84.38,44.36) v1(84.38,42.36) v1(86.13,29.15) v1(86.38,70.36) v1(86.38,66.36) v1(86.38,64.36) v1(86.38,62.36) v1(86.38,60.36) v1(86.38,58.36) v1(86.38,54.36) v1(86.38,52.36) v1(86.38,50.36) v1(88.38,62.36) v1(88.38,60.36) v1(88.38,58.36) v1(88.38,56.36) v1(88.38,52.36) v1(88.38,50.36) v1(88.38,48.36) v1(88.38,42.36) v1(90.13,19.15) v1(90.38,68.36) v1(90.38,66.36) v1(90.38,64.36) v1(90.38,62.36) v1(90.38,60.36) v1(90.38,58.36) v1(90.38,56.36) v1(90.38,54.36) v1(90.38,50.36) v1(90.38,48.36) v1(90.38,44.36) v1(90.38,36.36) v1(92.38,66.36) v1(92.38,64.36) v1(92.38,62.36) v1(92.38,60.36) v1(92.38,58.36) v1(92.38,56.36) v1(92.38,54.36) v1(92.38,52.36) v1(92.38,30.36) v1(92.38,28.36) v1(92.38,26.36) v1(92.38,24.36) v1(92.38,22.36) v1(92.38,20.36) v1(92.38,18.36) v1(92.38,16.36) v1(94.38,64.36) v1(94.38,62.36) v1(94.38,60.36) v1(94.38,58.36) v1(94.38,56.36) v1(94.38,54.36) v1(94.38,52.36) v1(94.38,50.36) v1(94.38,48.36) v1(94.38,46.36) v1(94.38,44.36) v1(94.38,42.36) v1(94.38,40.36) v1(94.38,38.36) v1(94.38,36.36) v1(94.38,34.36) v1(94.38,32.36) v1(94.38,30.36) v1(94.38,28.36) v1(94.38,26.36) v1(94.38,24.36) v1(94.38,22.36) v1(94.38,20.36) v1(94.38,18.36) v1(94.38,16.36) v1(94.38,14.36) v1(94.38,12.36) v1(94.38,10.36) v1(94.38,8.36) v1(96.38,64.36) v1(96.38,62.36) v1(96.38,60.36) v1(96.38,58.36) v1(96.38,56.36) v1(96.38,54.36) v1(96.38,52.36) v1(96.38,50.36) v1(96.38,48.36) v1(96.38,46.36) v1(96.38,44.36) v1(96.38,42.36) v1(96.38,40.36) v1(96.38,38.36) v1(96.38,36.36) v1(96.38,34.36) v1(96.38,32.36) v1(96.38,30.36) v1(96.38,28.36) v1(96.38,26.36) v1(96.38,24.36) v1(96.38,22.36) v1(96.38,20.36) v1(96.38,18.36) v1(96.38,16.36) v1(96.38,14.36) v1(96.38,12.36) v1(96.38,10.36) v1(96.38,8.36) v1(96.38,6.36) v1(96.38,4.36) v1(98.38,26.36) v1(98.38,24.36) v1(98.38,22.36) v1(98.38,20.36) v1(98.38,18.36) v1(98.38,16.36) v1(98.38,14.36) v1(98.38,12.36) v1(98.38,10.36) v1(98.38,8.36) v1(98.38,6.36) v1(98.38,4.36)
V1: length 37.2
  Inner1 w0.254: 23.21,44.4 27.08,40.53 27.08,25.15 38.25,13.97 U10.14
V2: length 40.5
  Inner1 w0.254: U10.24 13.11,13.97 8.36,18.72 8.36,31.32 8.54,31.5 13.03,31.5 v1(15.06,33.53)
  Inner2 w0.254: 23.21,41.86 21.99,40.64 19.2,40.64 15.14,36.58 15.14,33.6 v1(15.06,33.53)
V3: length 35.5
  Inner1 w0.254: U10.15 35.71,13.97 26.57,23.11 26.57,35.73 24.2,38.1 22.72,38.1 22,38.82 22,40.53 20.67,41.86
V4: length 23.7
  Inner1 w0.254: 23.21,34.24 26.06,31.39 26.06,18.8 30.89,13.97 U10.17
V5: length 21
  Inner1 w0.254: U10.18 22,20.57 22,30.37 20.67,31.7
2_LED: length 106.7
  Top Layer w0.254: R33.1 16.15,70.35 24.79,78.99 70.26,78.99 74.07,75.18 74.07,71.63 78.13,67.56 R35.1 84.49,49.8 79.09,44.4
ADC_INA00: length 67.9
  Top Layer w0.254: U51.2 31.09,64.64 U15.16 32.32,60.45 34.7,60.45 37.75,57.4 37.75,45.97 44.1,39.62 67.72,39.62 75.34,32 76.35,32 U18.51
ADC_INA01: length 81.3
  Top Layer w0.254: U18.52 77.88,30.48 76.1,30.48 67.46,39.12 43.84,39.12 37.24,45.72 37.24,57.15 34.44,59.94 31.14,59.94 29.62,61.47 29.62,65.53 30,65.91 32.36,65.91 U51.3 33.43,61.88 U15.15
ADC_INA02: length 86
  Top Layer w0.254: U18.53 75.74,30.08 75.68,30.08 67.15,38.61 43.59,38.61 36.73,45.47 36.73,56.9 34.19,59.44 30.82,59.44 27.08,63.18 27.08,63.57 ; 27.08,63.57 27.08,63.57 ; 27.08,63.57 27.08,66.04 27.36,66.32 34.49,66.32 U51.4 36.17,64.64 U15.14
ADC_INA03: length 94.6
  Top Layer w0.254: U15.13 38.51,61.88 U51.5 36.55,66.8 27.08,66.8 26.57,66.29 26.57,62.93 30.57,58.93 33.94,58.93 36.33,56.54 36.33,45.04 43.27,38.1 66.96,38.1 75.08,29.97 75.08,28.7 75.85,27.94 77.88,27.94 U18.54
ADC_INA04: length 99.5
  Top Layer w0.254: U15.12 41.05,61.88 U51.6 40.01,65.88 38.92,65.88 37.75,67.06 37.75,68.33 36.73,69.34 28.6,69.34 26.06,66.8 26.06,62.67 30.32,58.42 33.87,58.42 35.91,56.38 35.91,44.76 43.08,37.59 66.81,37.59 74.68,29.72 74.68,27.58 75.59,26.67 U18.55
ADC_INA05: length 108
  Top Layer w0.254: U18.56 77.88,25.4 75.59,25.4 74.28,26.72 74.28,29.46 66.66,37.08 42.83,37.08 35.46,44.45 35.46,56.13 33.68,57.91 30.06,57.91 25.66,62.32 25.66,66.97 28.43,69.75 39.12,69.75 40.03,68.83 40.03,66.8 40.29,66.55 41.81,66.55 43.52,64.84 U51.7 43.59,61.88 U15.11
ADC_INA06: length 114.5
  Top Layer w0.254: U15.10 46.13,61.88 U51.8 46.13,65.02 44.86,66.29 43.59,66.29 42.83,67.06 42.83,68.33 42.32,68.83 42.32,71.88 41.81,72.39 27.33,72.39 26.82,71.88 26.82,68.83 25.25,67.26 25.25,62.02 29.87,57.4 33.43,57.4 34.95,55.88 34.95,44.2 42.57,36.58 66.45,36.58 73.87,29.16 73.87,26.55 76.29,24.13 U18.57
ADC_INA07: length 122.9
  Top Layer w0.254: U15.9 48.87,64.64 U51.9 47.22,66.29 46.13,66.29 45.37,67.06 45.37,68.58 44.86,69.09 44.86,71.88 43.84,72.9 27.08,72.9 26.32,72.14 26.32,69.09 24.79,67.56 24.79,61.72 29.62,56.9 33.17,56.9 34.44,55.63 34.44,43.94 42.32,36.07 66.19,36.07 73.47,28.79 73.47,24.98 75.59,22.86 77.88,22.86 U18.58
ADC_INB00: length 52.4
  Top Layer w0.254: U52.9 51.71,61.98 U15.8 52.48,60.61 52.48,57.15 53.49,56.13 64.16,56.13 65.69,54.61 65.69,52.58 72.04,46.23 72.04,36.32 75.34,33.02 77.88,33.02 U18.50
ADC_INB01: length 45.6
  Top Layer w0.254: U18.49 76.1,34.8 75.34,34.8 72.54,37.59 72.54,46.48 66.19,52.83 66.19,54.86 64.42,56.64 55.78,56.64 55.02,57.4 55.02,60.61 U15.7 54.25,61.98 U52.8
ADC_INB02: length 45.4
  Top Layer w0.254: 79.09,36.78 77.87,35.56 75.59,35.56 73.05,38.1 73.05,46.74 66.7,53.09 66.7,58.42 66.19,58.93 64.36,58.93 64.33,58.96 59.21,58.96 U15.6 56.79,61.98 U52.7
ADC_INB03: length 39
  Top Layer w0.254: U52.6 59.33,61.98 U15.5 61.27,59.44 66.7,59.44 67.21,58.93 67.21,53.34 73.56,46.99 73.56,39.12 75.9,36.78 76.55,36.78
ADC_INB04: length 39
  Top Layer w0.254: U52.5 61.87,61.98 U15.4 63.31,59.94 66.96,59.94 67.72,59.18 67.72,53.59 74.07,47.24 74.07,39.37 75.34,38.1 77.87,38.1 79.09,39.32
ADC_INB05: length 31.9
  Top Layer w0.254: U52.4 64.41,61.98 U15.3 65.34,60.45 67.21,60.45 68.23,59.44 68.23,53.85 74.58,47.5 74.58,41.3 76.55,39.32
ADC_INB06: length 31.9
  Top Layer w0.254: 79.09,41.86 77.87,40.64 75.85,40.64 75.02,41.47 75.02,47.82 68.73,54.1 68.73,59.6 U15.2 66.95,61.98 U52.3
ADC_INB07: length 26.2
  Top Layer w0.254: U52.2 69.49,61.98 U15.1 69.24,61.63 69.24,54.36 75.42,48.18 75.42,43.93 76.55,42.8 76.55,41.86
BUZZ: length 32.9
  Top Layer w0.254: 23.21,29.16 25.05,30.99 25.05,47.24 24.03,48.26 17.17,48.26 13.12,52.32 R34.2
GPIO0: length 26.5
  Top Layer w0.254: R9.1 89.53,38.07 U4.0
  Bottom Layer w0.254: U4.0 88.29,36.83 83.72,36.83 79.91,40.64 75.85,40.64 74.83,41.66 74.83,45.47 76.3,46.94 76.55,46.94
GPIO1: length 18.7
  Top Layer w0.254: R10.1 89.49,40.57 U4.1
  Bottom Layer w0.254: 76.55,44.4 76.66,44.4 77.88,43.18 79.91,43.18 83.72,39.37 88.29,39.37 U4.1
GPIO2: length 16
  Top Layer w0.254: U4.2 89.53,43.15 R11.1
  Bottom Layer w0.254: 79.09,46.94 87.33,46.94 88.29,45.97 88.29,44.74 88.27,44.72 89.56,43.43 U4.2
GPIO3: length 15.1
  Top Layer w0.254: R12.1 89.53,45.69 U4.3
  Bottom Layer w0.254: U4.3 85.8,49.48 79.09,49.48
GPIO4: length 40.2
  Top Layer w0.254: U50.1 43.87,50.57 R25.1
  Bottom Layer w0.254: 79.09,52.02 77.87,50.8 65.34,50.8 64.58,51.56 45.11,51.56 43.81,50.26 U50.1
GPIO5: length 48.3
  Top Layer w0.254: R26.1 46.27,50.43 U50.2
  Bottom Layer w0.254: U50.2 44.61,48.77 42.57,48.77 42.06,49.28 42.06,51.05 43.33,52.32 64.42,52.32 65.43,53.34 77.87,53.34 79.09,54.56
GPIO6: length 35.7
  Top Layer w0.254: R27.1 48.87,50.49 U50.3
  Bottom Layer w0.254: 20.67,54.56 21.99,55.88 34.7,55.88 42.32,48.26 46.64,48.26 U50.3
GPIO7: length 37.6
  Top Layer w0.254: U50.4 51.47,50.55 R28.1
  Bottom Layer w0.254: 20.67,52.02 21.19,52.02 22.51,53.34 36.48,53.34 42.06,47.75 48.68,47.75 U50.4
GPIO8: length 36.9
  Top Layer w0.254: R29.1 53.97,50.51 U50.5
  Bottom Layer w0.254: 23.21,52.02 37.03,52.02 41.81,47.24 50.71,47.24 U50.5
GPIO9: length 42.3
  Top Layer w0.254: U50.6 56.47,50.47 R30.1
  Bottom Layer w0.254: U50.6 52.74,46.74 41.56,46.74 37.49,50.8 21.99,50.8 20.67,49.48
GPIO10: length 44.2
  Top Layer w0.254: U50.7 58.97,50.43 R31.1
  Bottom Layer w0.254: U50.7 54.77,46.23 41.3,46.23 39.27,48.26 21.99,48.26 20.67,46.94
GPIO11: length 47.1
  Top Layer w0.254: R32.1 61.47,50.39 U50.8
  Bottom Layer w0.254: U50.8 56.9,45.81 41.02,45.81 39.84,46.99 25.81,46.99 24.63,45.81 22.6,45.81 21.19,44.4 20.67,44.4
GPIO12: length 28
  Top Layer w0.254: U48.0 12.73,45.72 R13.1
  Bottom Layer w0.254: U48.0 11.84,43.43 11.84,37.34 13.62,35.56 21.49,35.56 22,35.05 22,33.27 23.21,32.06 23.21,31.7
GPIO13: length 21
  Top Layer w0.254: R14.1 12.73,43.18 U48.1
  Bottom Layer w0.254: 20.67,34.24 14.17,34.24 11.33,37.08 11.33,41.4 U48.1
GPIO14: length 27.5
  Top Layer w0.254: R15.1 9.9,40.29 U48.2
  Bottom Layer w0.254: 20.67,24.08 17.93,24.08 8.28,33.73 8.28,39.37 U48.2
GPIO15: length 25.8
  Top Layer w0.254: U48.3 12.73,38.1 R16.1
  Bottom Layer w0.254: 23.21,24.08 21.89,25.4 17.68,25.4 9.55,33.53 U48.3
L_LED: length 56.5
  Inner1 w0.254: U18.16 19.97,39.37 19.1,40.24 19.1,63.08 25.45,69.43 25.45,71.71 26.74,73 31.56,73 37.05,78.49 39.45,78.49 v1(39.52,78.41)
  Bottom Layer w0.254: U17.5 39.69,78.24 v1(39.52,78.41)
PUB_LED4: length 34.7
  Bottom Layer w0.254: U17.7 41.69,74.05 40.03,72.39 32.92,72.39 32.41,71.88 32.41,65.29 32.39,65.27 32.39,64.41 32.41,64.39 32.41,60.45 32.67,60.2 35.46,60.2 37.49,58.17 43.28,58.17 U50.18
PUB_LED5: length 31.5
  Bottom Layer w0.254: U17.8 42.69,74.23 39.78,71.32 39.78,70.61 38.76,69.6 35.71,69.6 35.21,69.09 35.21,66.29 34.82,65.91 34.82,61.09 35.21,60.71 35.67,60.71 35.74,60.64 35.78,60.64 37.46,58.96 45.03,58.96 U50.17
PUB_LED6: length 29.9
  Bottom Layer w0.254: U17.9 43.69,73.76 42.32,72.39 42.32,70.61 41.56,69.85 41.05,69.85 40.29,69.09 40.29,67.82 39.02,66.55 38.25,66.55 37.49,65.79 37.49,65.29 37.47,65.27 37.47,64.41 37.49,64.39 37.49,60.71 38.76,59.44 45.37,59.44 45.62,59.18 47.34,59.18 U50.16
PUB_LED7: length 29.3
  Bottom Layer w0.254: U17.10 44.69,70.19 44.35,69.85 43.84,69.85 42.83,68.83 42.83,67.82 41.81,66.8 40.79,66.8 39.78,65.79 39.78,61.47 41.3,59.94 45.62,59.94 45.87,59.69 49.37,59.69 U50.15
PUB_LED8: length 29.2
  Bottom Layer w0.254: U17.11 45.37,74.62 45.37,71.82 45.13,71.59 45.13,70.73 45.37,70.49 45.37,67.06 44.86,66.55 43.08,66.55 42.32,65.79 42.32,63.5 42.57,63.25 42.57,60.96 43.08,60.45 45.62,60.45 45.72,60.35 45.79,60.35 45.94,60.2 49.94,60.2 50.95,59.18 52.42,59.18 U50.14
PUB_LED9: length 24.6
  Bottom Layer w0.254: U17.12 46.64,74.89 46.64,72.9 47.4,72.14 47.4,69.6 47.91,69.09 47.91,67.06 47.4,66.55 47.4,63.25 47.65,62.99 47.65,61.21 48.16,60.71 48.37,60.71 48.44,60.64 49.3,60.64 49.37,60.71 50.45,60.71 51.21,59.94 52.48,59.94 53.24,59.18 54.96,59.18 U50.13
PUB_LED10: length 25.2
  Bottom Layer w0.254: U17.13 47.69,73.87 50.19,71.37 50.19,67.56 49.68,67.06 49.68,65.3 49.71,65.27 49.71,64.41 49.68,64.38 49.68,63.25 50.19,62.74 51.97,62.74 52.48,62.23 52.48,60.71 53.49,59.69 55.53,59.69 56.03,59.18 57.5,59.18 U50.12
PUB_LED11: length 25.7
  Bottom Layer w0.254: U17.14 48.69,73.64 49.94,72.39 52.22,72.39 52.99,71.63 52.99,64.26 53.75,63.5 54,63.5 55.02,62.48 55.02,60.96 56.29,59.69 57.81,59.69 58.32,59.18 60.04,59.18 U50.11
Q0: length 25.9
  Inner1 w0.254: U16.16 31.29,70.8 U11.2
  Inner2 w0.254: v1(49.68,76.71) 48.92,76.71 46.64,74.42 34.2,74.42 U11.2
  Bottom Layer w0.254: U17.15 49.68,74.95 v1(49.68,76.71)
Q1: length 35
  Inner1 w0.254: U11.3 33.83,70.8 U16.15
  Inner2 w0.254: U11.3 32.16,69.85 30.38,69.85 29.62,70.61 29.62,71.88 32.67,74.93 46.38,74.93 48.92,77.47 v1(50.7,77.47)
  Bottom Layer w0.254: U17.16 50.7,74.95 v1(50.7,77.47)
Q2: length 45.3
  Inner1 w0.254: U11.4 36.01,68.56 U16.14
  Inner2 w0.254: U11.4 34.2,69.34 28.09,69.34 27.08,70.36 27.08,71.88 27.84,72.64 29.62,72.64 32.41,75.44 46.13,75.44 48.92,78.23 v1(51.72,78.23)
  Bottom Layer w0.254: v1(51.72,78.23) 51.72,74.97 U17.17
Q3: length 54.2
  Inner1 w0.254: U11.5 38.91,70.8 U16.13
  Inner2 w0.254: U11.5 37.75,70.35 37.75,67.56 37.24,67.06 29.36,67.06 26.67,69.75 26.67,72.05 27.67,73.05 29.45,73.05 32.35,75.95 45.87,75.95 48.79,78.87 52.1,78.87 v1(52.73,78.23)
  Bottom Layer w0.254: U17.18 52.73,74.99 v1(52.73,78.23)
Q4: length 59.5
  Inner1 w0.254: U11.6 41.45,70.8 U16.12
  Inner2 w0.254: U11.6 39.95,70.02 39.95,67.77 38.73,66.55 29.3,66.55 26.27,69.58 26.27,72.22 27.55,73.49 29.32,73.49 32.29,76.45 45.62,76.45 48.67,79.5 52.73,79.5 53.75,78.49 v1(53.75,78.23)
  Bottom Layer w0.254: v1(53.75,78.23) 53.75,75 U17.19
Q5: length 65
  Inner1 w0.254: U16.11 43.63,68.56 U11.7
  Inner2 w0.254: v1(54.51,78.23) 54.51,78.49 52.99,80.01 48.41,80.01 45.37,76.96 32.16,76.96 29.09,73.9 27.38,73.9 25.87,72.38 25.87,69.41 29.24,66.04 41.3,66.04 42.57,67.31 42.57,70.1 U11.7
  Bottom Layer w0.254: U17.20 54.51,75.13 v1(54.51,78.23)
Q6: length 75.7
  Inner1 w0.254: U11.8 46.17,68.56 U16.10
  Inner2 w0.254: v1(55.53,77.98) 55.53,78.49 53.49,80.52 48.16,80.52 45.06,77.42 31.86,77.42 28.86,74.42 27.33,74.42 25.46,72.55 25.46,69.18 26.82,67.82 26.82,64.15 27.33,63.64 43.96,63.64 45.09,64.77 45.09,70.08 U11.8
  Bottom Layer w0.254: U17.21 55.53,75.11 v1(55.53,77.98)
Q7: length 81.5
  Inner1 w0.254: U16.9 49.07,70.8 U11.9
  Inner2 w0.254: v1(56.54,77.98) 56.54,78.49 54,81.03 47.91,81.03 44.71,77.83 31.69,77.83 28.79,74.93 27.27,74.93 25.06,72.72 25.06,69.01 26.32,67.75 26.32,64.01 27.33,62.99 46.38,62.99 47.4,64.01 47.4,65.79 47.91,66.29 47.91,70.35 U11.9
  Bottom Layer w0.254: v1(56.54,77.98) 56.54,75.1 U17.22
Q8: length 11.1
  Inner1 w0.254: U16.8 51.71,68.3 U12.9
  Inner2 w0.254: U12.9 53.24,72.61 v1(53.24,72.9)
  Bottom Layer w0.254: U17.23 57.28,74.53 57.28,73.83 56.34,72.9 v1(53.24,72.9)
Q9: length 9.4
  Inner1 w0.254: U12.8 54.25,68.3 U16.7
  Bottom Layer w0.254: U12.8 55.67,72.49 56.94,72.49 58.69,74.25 U17.24
Q10: length 8
  Inner1 w0.254: U12.7 56.79,68.3 U16.6
  Bottom Layer w0.254: U12.7 59.69,73.98 U17.25
Q11: length 7.4
  Inner1 w0.254: U12.6 59.33,68.3 U16.5
  Bottom Layer w0.254: U12.6 59.59,71.34 59.59,72.64 60.69,73.75 U17.26
Q12: length 6.9
  Inner1 w0.254: U16.4 61.87,68.3 U12.5
  Bottom Layer w0.254: U12.5 61.87,74.77 U17.27
Q13: length 7.5
  Inner1 w0.254: U16.3 64.41,68.3 U12.4
  Bottom Layer w0.254: U17.28 62.89,74.75 62.89,72.6 U12.4
Q14: length 9
  Inner1 w0.254: U12.3 66.95,68.3 U16.2
  Bottom Layer w0.254: U12.3 65.64,72.39 64.16,72.39 63.69,72.86 U17.29
Q15: length 10.1
  Inner1 w0.254: U16.1 69.49,68.3 U12.2
  Bottom Layer w0.254: U17.30 64.69,73.64 65.18,73.15 67.42,73.15 U12.2
R_LED: length 60.7
  Inner1 w0.254: U18.18 18.7,38.86 18.7,63.25 25.05,69.6 25.05,71.88 26.57,73.41 31.4,73.41 36.98,78.99 39.96,78.99 v1(40.54,78.41)
  Bottom Layer w0.254: U17.6 40.54,75.1 v1(40.54,78.41)
SW_D: length 119.3
  Top Layer w0.254: R23.2 85.69,5.28 U57.D 73.7,17.27 20.98,17.27 16.41,21.84 16.41,36.65 20.4,40.64 23.78,40.64 24.54,39.88 24.54,38.86 23.78,38.1 22.76,38.1 22,37.34 22,27.83 23.21,26.62
SW_L: length 99.7
  Top Layer w0.254: R22.2 88,10.93 U57.L 75.73,17.78 21.24,17.78 16.92,22.1 16.92,35.56 19.46,38.1 21.99,38.1 23.21,39.32
SW_R: length 123.9
  Top Layer w0.254: R24.2 92.76,8.07 U57.R 95.15,5.98 95.15,5.08 93.88,3.81 84.74,3.81 71.78,16.76 20.73,16.76 15.9,21.59 15.9,41.91 19.71,45.72 21.99,45.72 23.21,46.94
SW_U: length 80.4
  Top Layer w0.254: 20.67,26.62 17.43,23.37 17.43,22.35 21.49,18.29 80.3,18.29 U57.U 87.89,13.3 R21.2
$1N3052: length 67.2
  Inner1 w0.254: U1.2 45.34,22.44 45.34,27.71 29.62,43.43 27.23,43.43 26.57,44.1 L1.1
  Inner2 w0.254: 60.68,43.9 58.74,43.9 58.62,43.77 40.14,43.77 40.01,43.9 27.63,43.9 L1.1
$1N13779: length 6.6
  Top Layer w0.254: R34.1 14.62,54.62 U6.2
$1N16910: length 3.3
  Top Layer w0.254: R33.2 14.49,67.67 U60.2
$1N16913: length 2.8
  Top Layer w0.254: R35.2 88.78,67.56 U54.2

## Copper pours and planes (outline as drawn; the poured copper is in the pictures)
50V on Bottom Layer: 8.28,37.6 90.83,37.6 90.83,2.79 8.28,2.79
50V on Inner2: 8.28,37.67 90.83,37.67 90.83,2.79 8.28,2.79
AGND on Top Layer: 26.32,83.31 80.42,83.31 80.42,55.88 26.32,55.88
AGND on Bottom Layer: 26.32,83.31 80.42,83.31 80.42,55.88 26.32,55.88
AGND on Inner1: 26.32,83.31 80.67,83.31 80.67,55.88 26.32,55.88
AGND on Inner2: 26.32,83.31 80.67,83.31 80.67,55.88 26.32,55.88
GND on Top Layer: -3.15,84.33 102.52,84.33 102.52,-1.27 -3.15,-1.27
GND on Bottom Layer: -3.15,84.58 102.77,84.58 102.77,-1.52 -3.15,-1.52
GND on Inner1: -2.89,84.84 103.02,84.84 103.02,-1.27 -2.89,-1.27
GND on Inner2: -2.64,84.58 103.02,84.58 103.02,-1.27 -2.64,-1.27
$1N2932 on Bottom Layer: 58.57,6.86 73.81,6.86 73.81,1.78 58.57,1.78
$1N2932 on Inner2: 58.57,6.86 73.81,6.86 73.81,1.78 58.57,1.78

## Text on the board
Top Silkscreen Layer: 2026 STEP TRACER RAY | SONG SEONG HYUK | By MAZE 30th SSH
